# Altium schematic sheet 0213_5V_L.SchDoc
size 848 x 558 mm
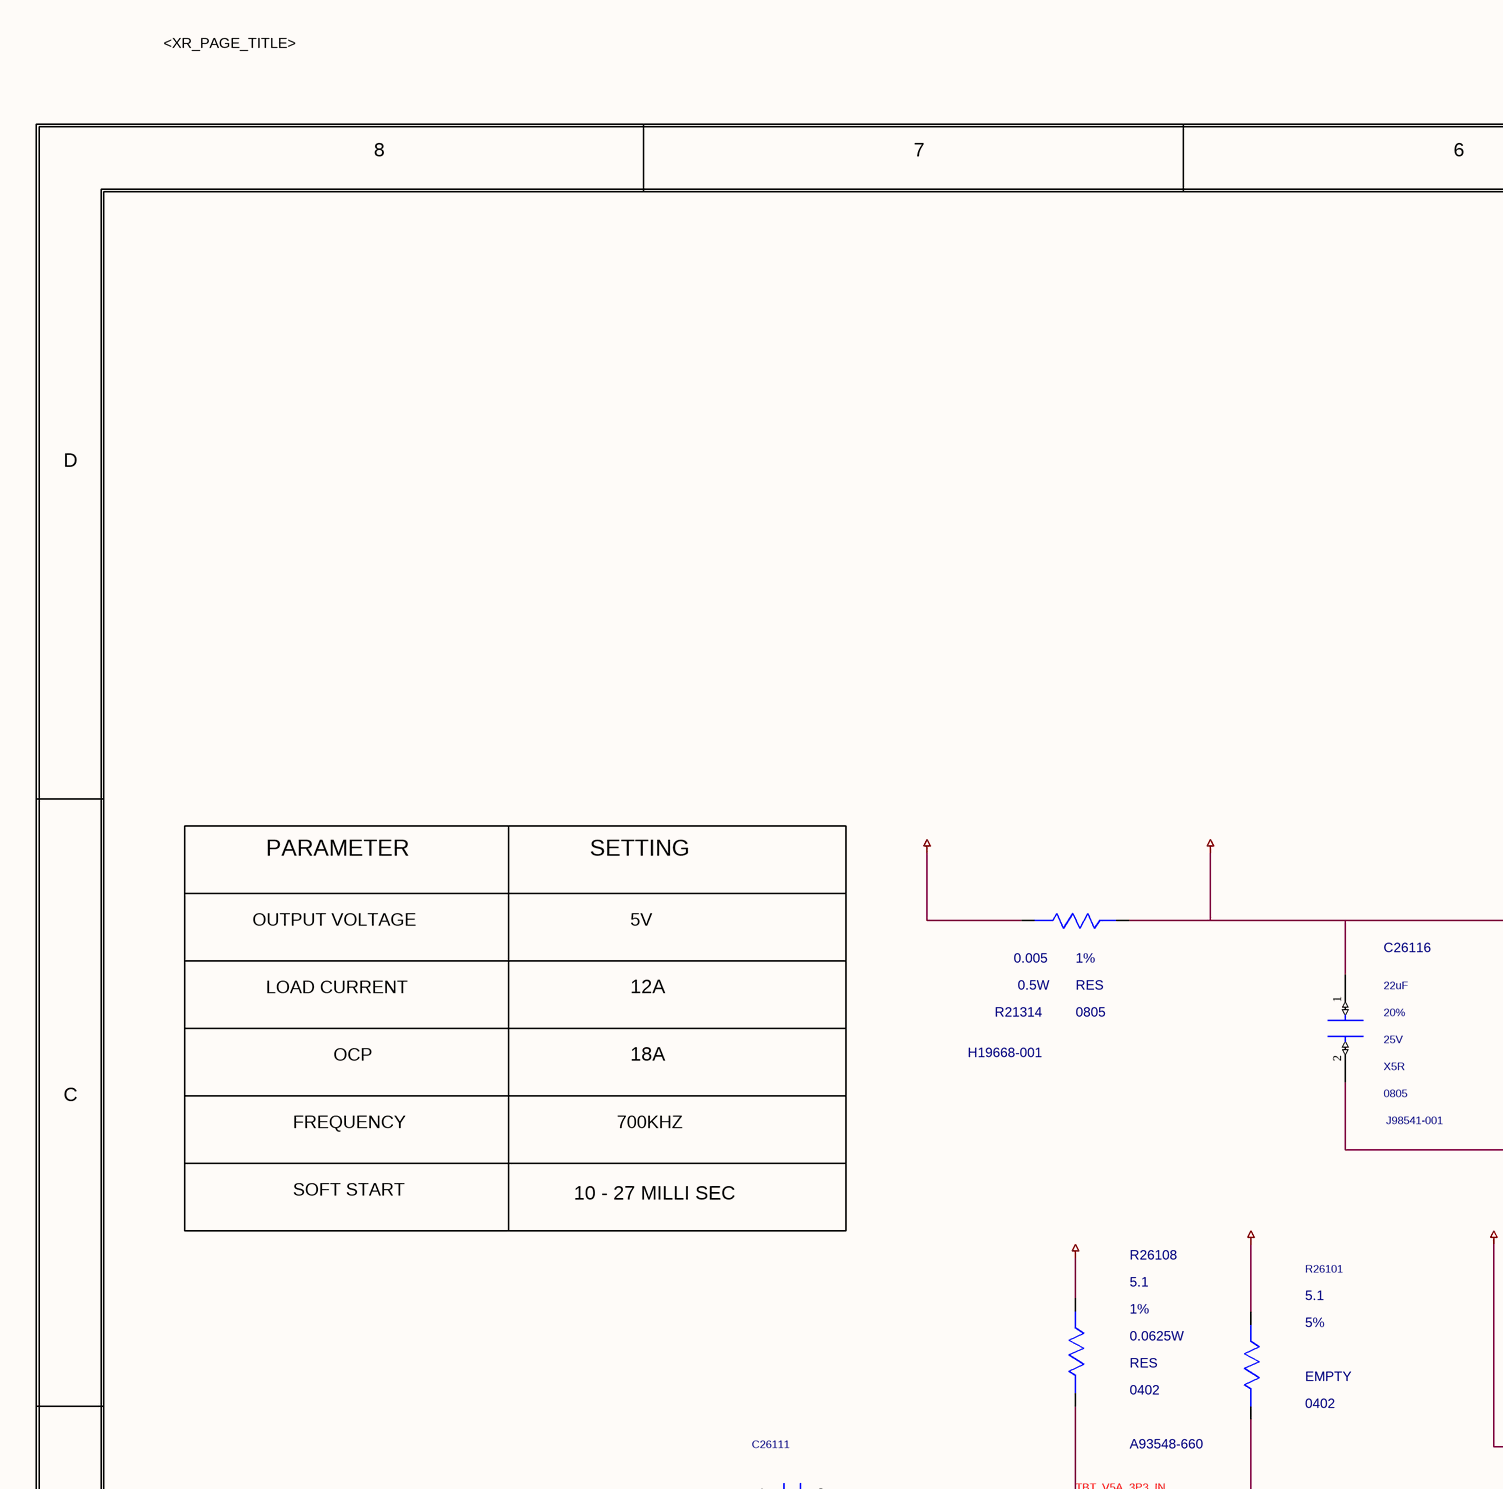
[diagram p0: 0213_5V_L.SchDoc, top left]
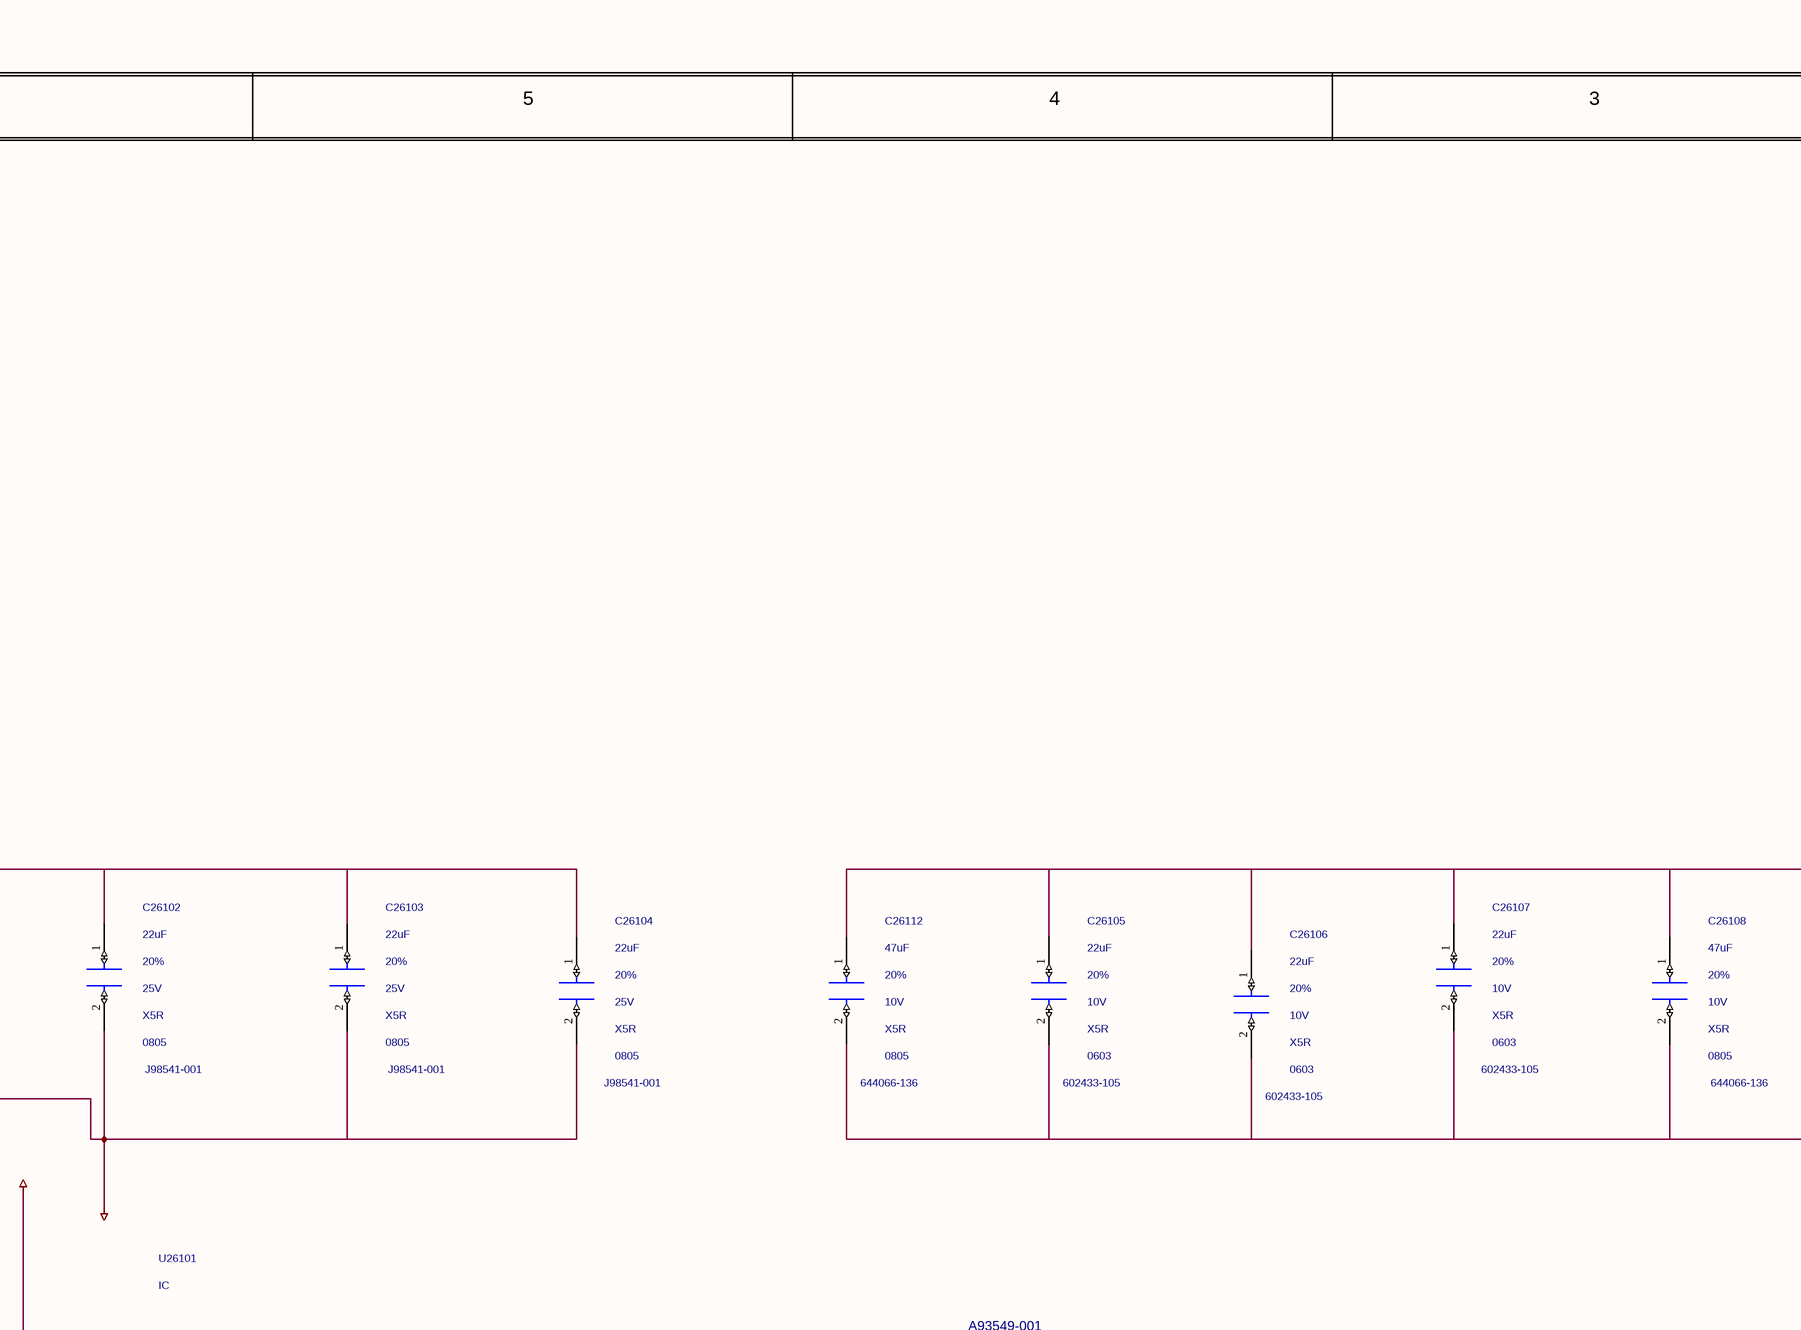
[diagram p1: 0213_5V_L.SchDoc, top middle]
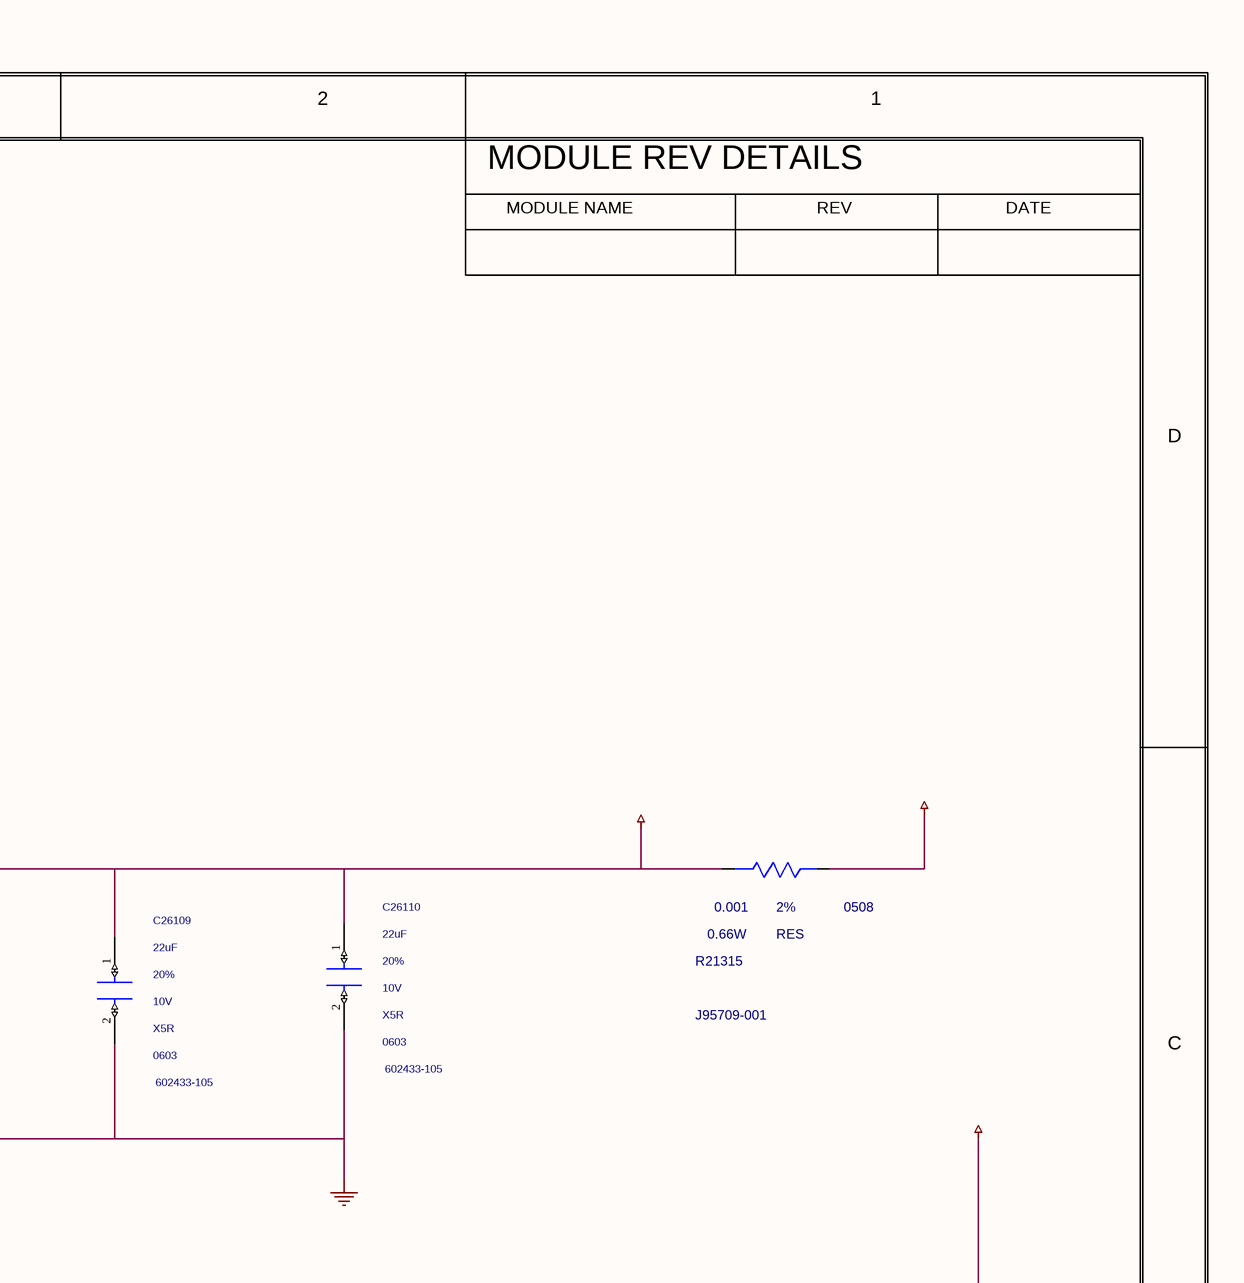
[diagram p2: 0213_5V_L.SchDoc, top right]
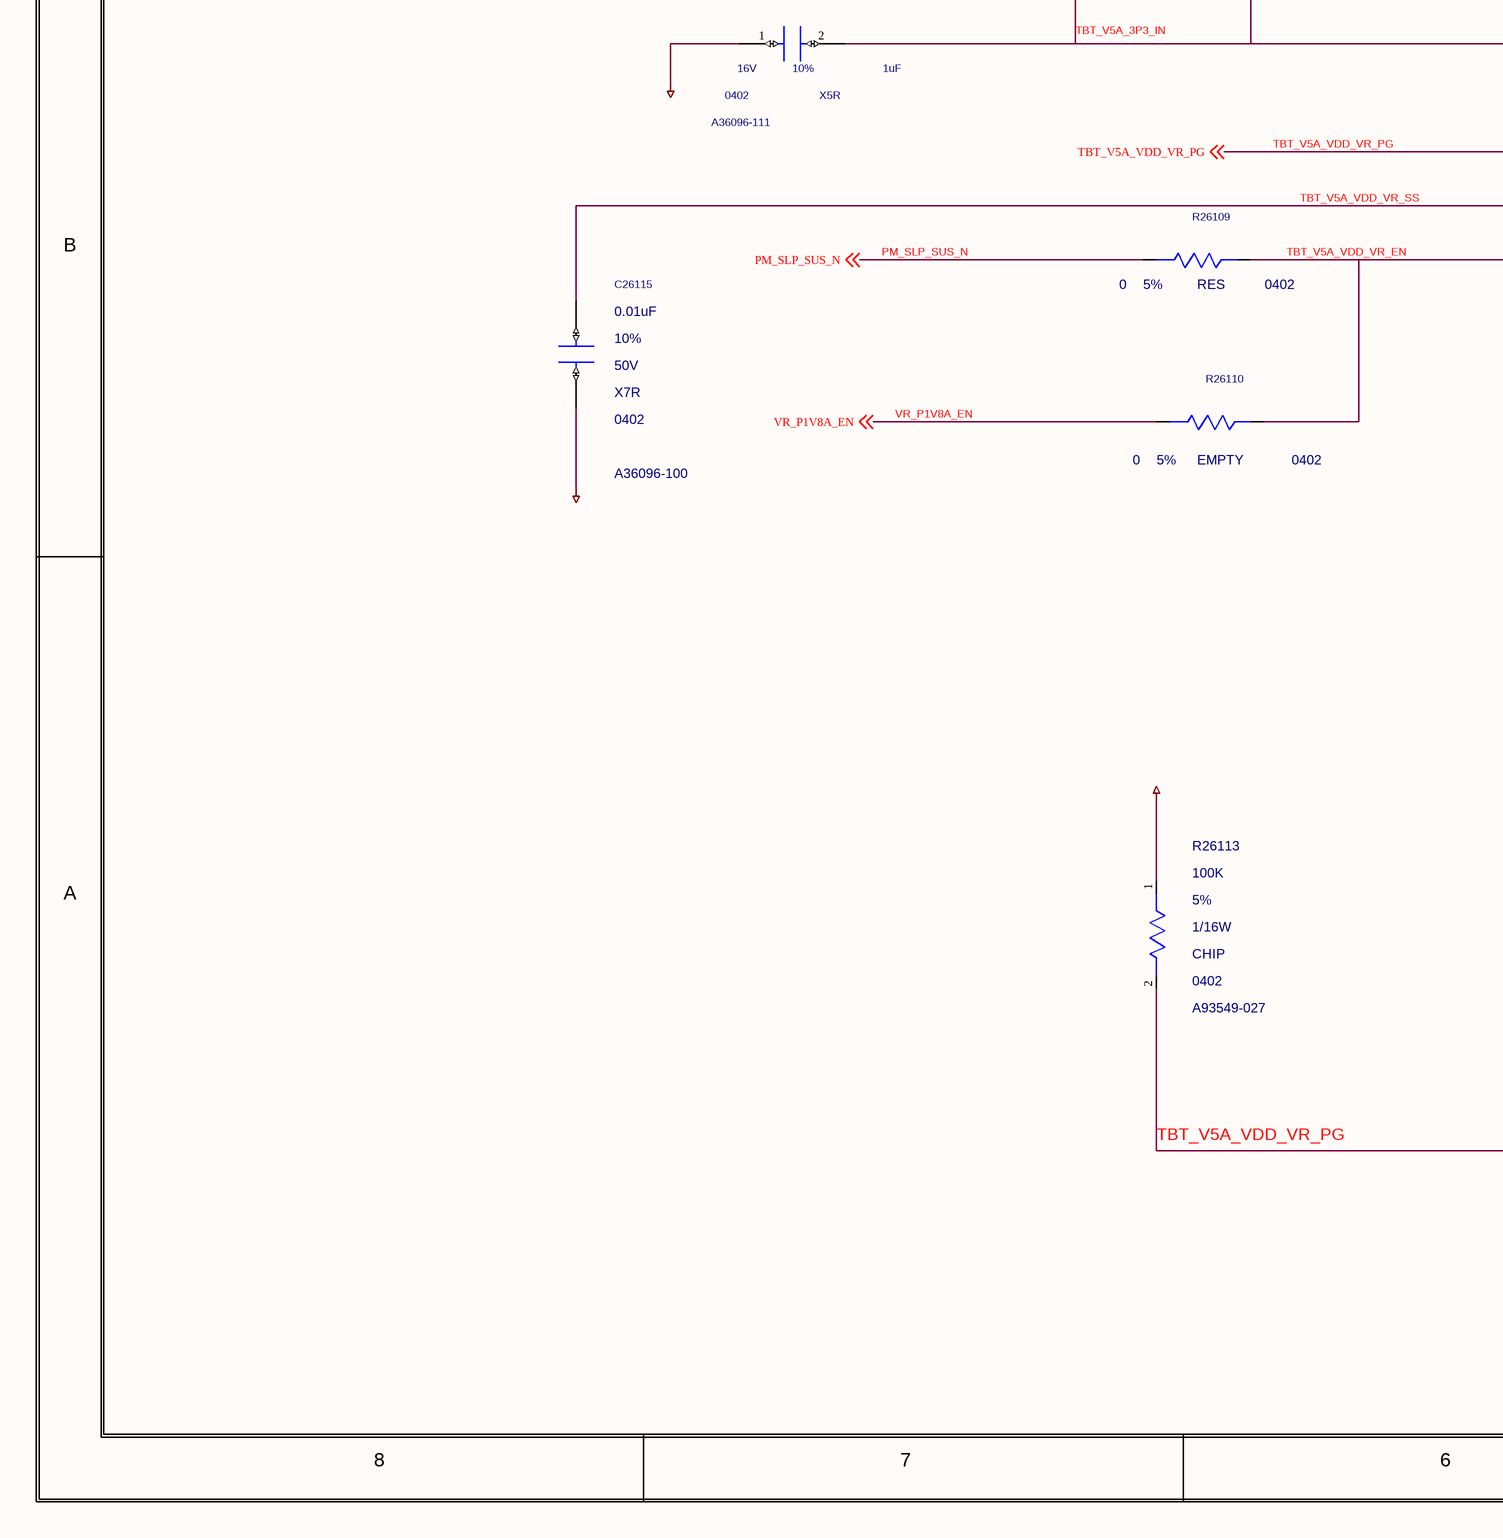
[diagram p3: 0213_5V_L.SchDoc, bottom left]
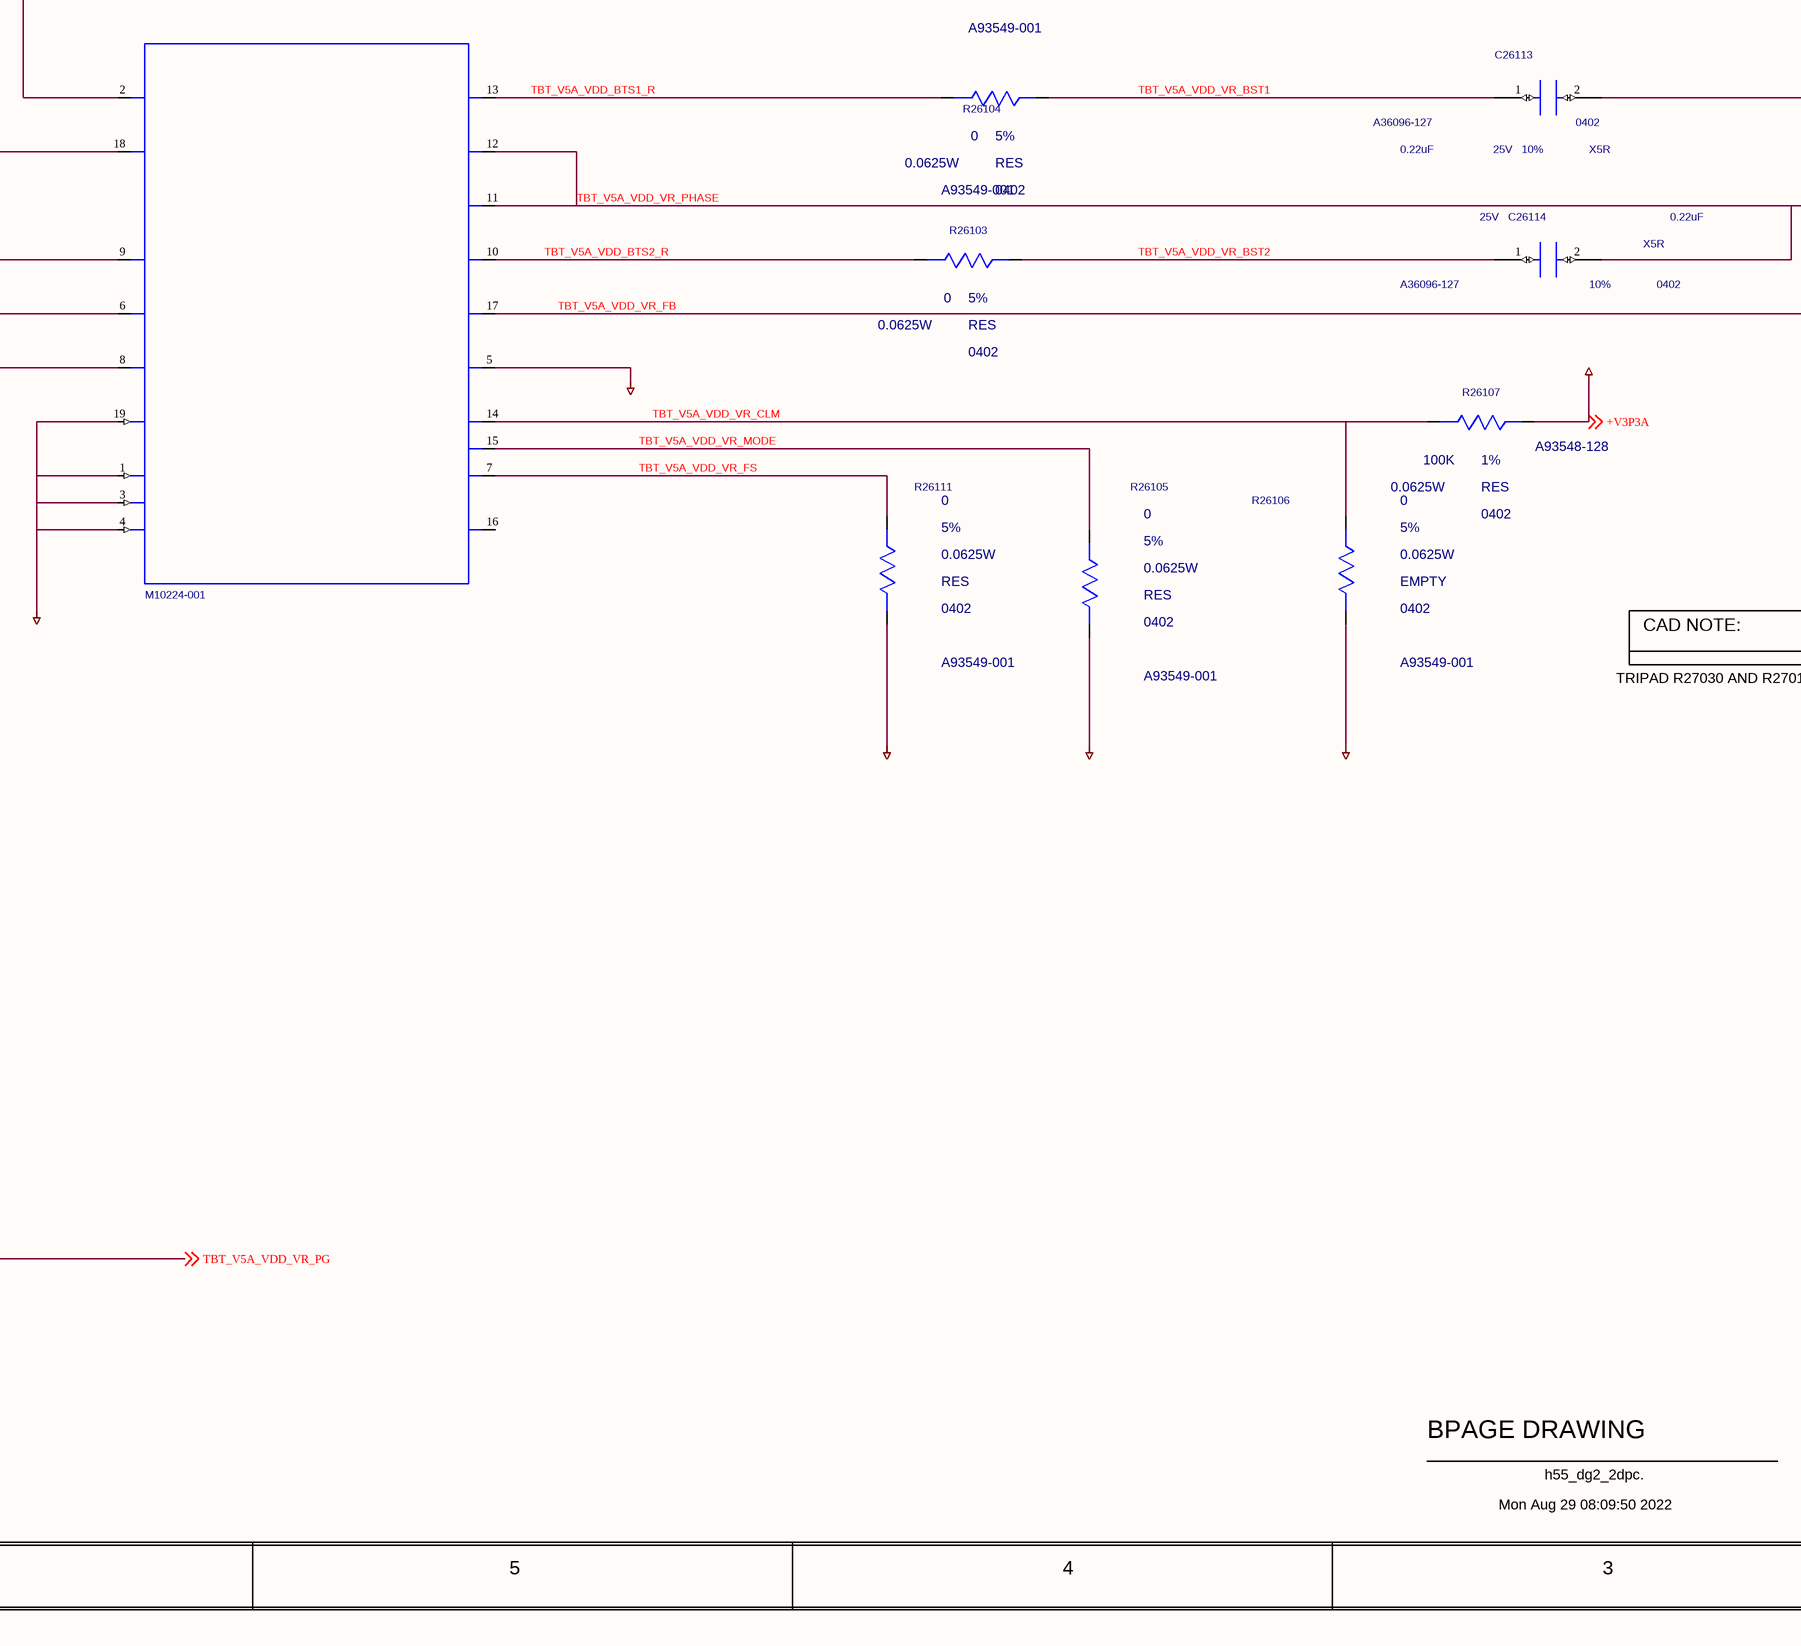
[diagram p4: 0213_5V_L.SchDoc, bottom middle]
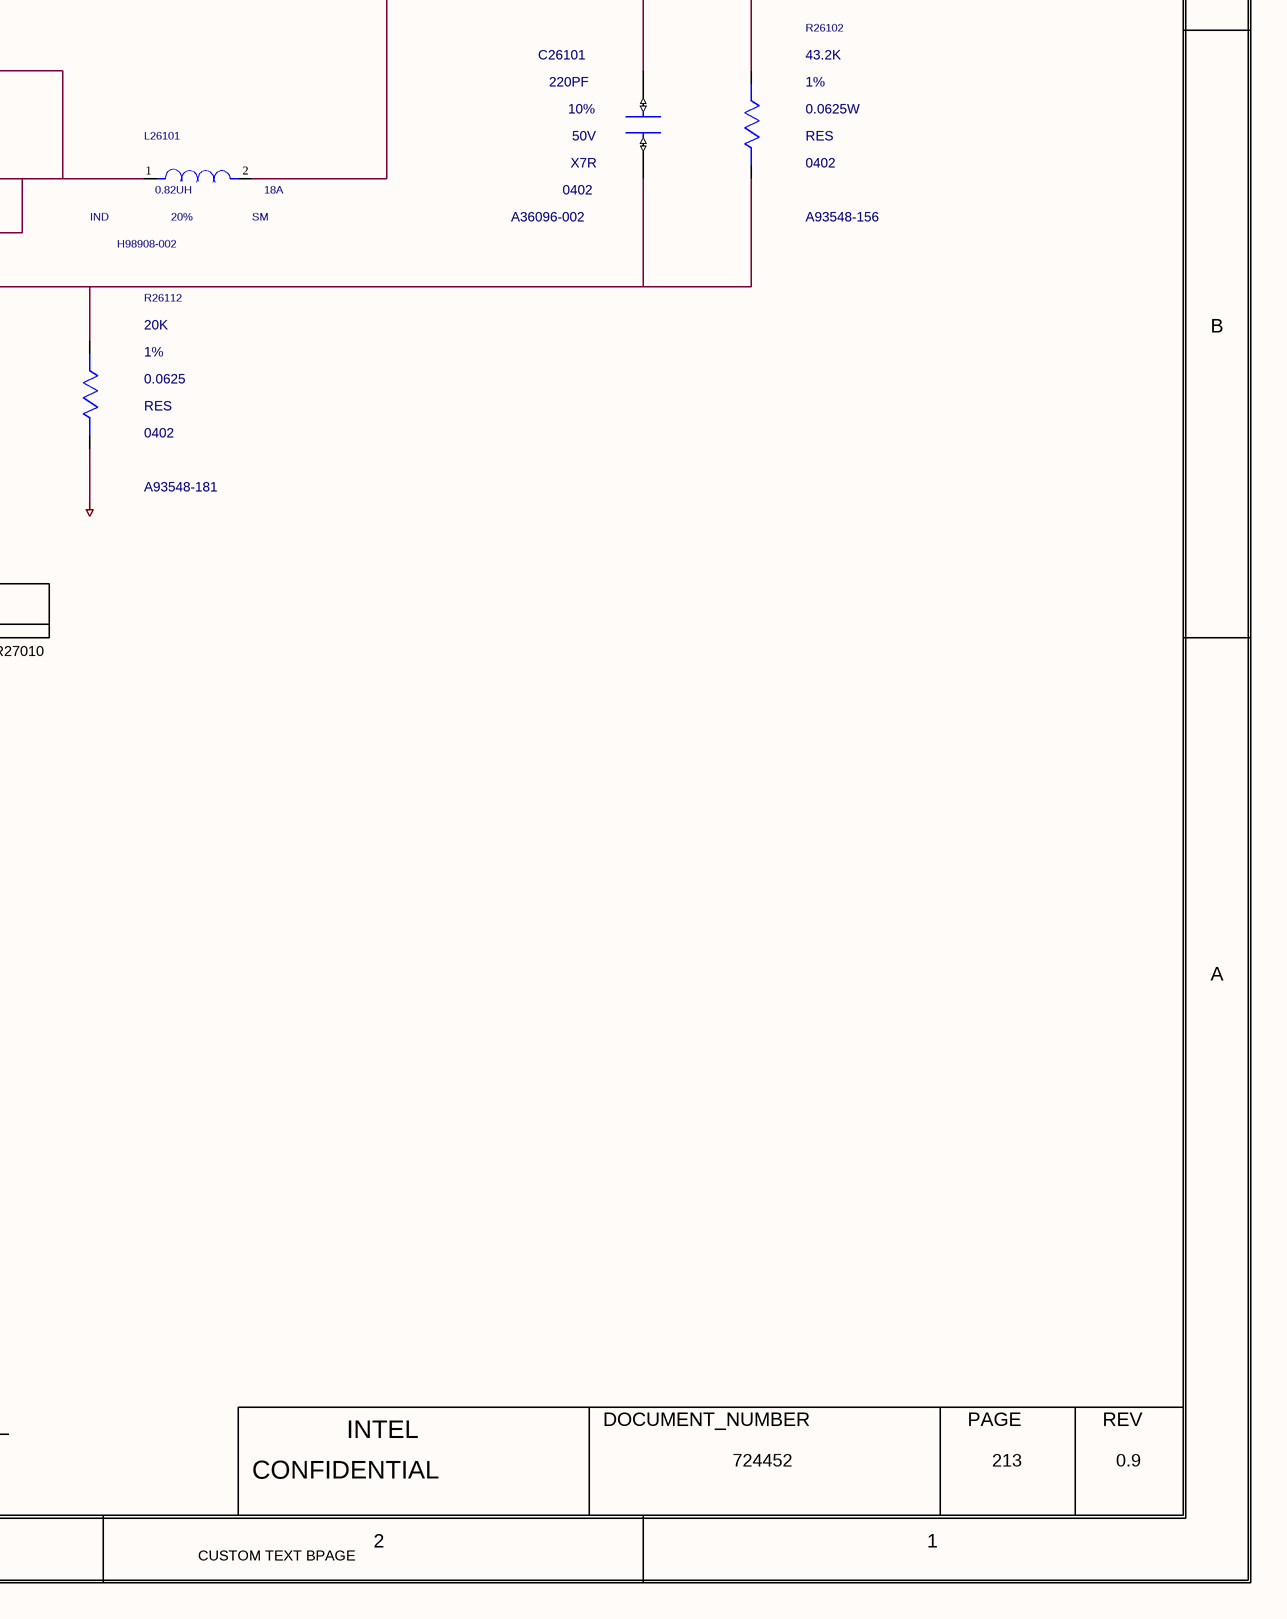
[diagram p5: 0213_5V_L.SchDoc, bottom right]

## Parts
C26101  220PF  MATERIAL: X7R  PACK_TYPE: 0402  PART_NUMBER: A36096-002  TOLERANCE: 10%  VOLTAGE: 50V  [CTK0_SM0402_1100X600_MA]
C26102  22uF  MATERIAL: X5R  PACK_TYPE: 0805  PART_NUMBER: J98541-001  TOLERANCE: 20%  VOLTAGE: 25V  [SMC0805MA]
C26103  22uF  MATERIAL: X5R  PACK_TYPE: 0805  PART_NUMBER: J98541-001  TOLERANCE: 20%  VOLTAGE: 25V  [SMC0805MA]
C26104  22uF  MATERIAL: X5R  PACK_TYPE: 0805  PART_NUMBER: J98541-001  TOLERANCE: 20%  VOLTAGE: 25V  [SMC0805MA]
C26105  22uF  MATERIAL: X5R  PACK_TYPE: 0603  PART_NUMBER: 602433-105  TOLERANCE: 20%  VOLTAGE: 10V  [SMC0603IA]
C26106  22uF  MATERIAL: X5R  PACK_TYPE: 0603  PART_NUMBER: 602433-105  TOLERANCE: 20%  VOLTAGE: 10V  [SMC0603IA]
C26107  22uF  MATERIAL: X5R  PACK_TYPE: 0603  PART_NUMBER: 602433-105  TOLERANCE: 20%  VOLTAGE: 10V  [SMC0603IA]
C26108  47uF  MATERIAL: X5R  PACK_TYPE: 0805  PART_NUMBER: 644066-136  TOLERANCE: 20%  VOLTAGE: 10V  [SMC0805MA]
C26109  22uF  MATERIAL: X5R  PACK_TYPE: 0603  PART_NUMBER: 602433-105  TOLERANCE: 20%  VOLTAGE: 10V  [SMC0603IA]
C26110  22uF  MATERIAL: X5R  PACK_TYPE: 0603  PART_NUMBER: 602433-105  TOLERANCE: 20%  VOLTAGE: 10V  [SMC0603IA]
C26111  1uF  MATERIAL: X5R  PACK_TYPE: 0402  PART_NUMBER: A36096-111  TOLERANCE: 10%  VOLTAGE: 16V  [SMC0402IA]
C26112  47uF  MATERIAL: X5R  PACK_TYPE: 0805  PART_NUMBER: 644066-136  TOLERANCE: 20%  VOLTAGE: 10V  [SMC0805MA]
C26113  0.22uF  MATERIAL: X5R  PACK_TYPE: 0402  PART_NUMBER: A36096-127  TOLERANCE: 10%  VOLTAGE: 25V  [SMC1005MB]
C26114  0.22uF  MATERIAL: X5R  PACK_TYPE: 0402  PART_NUMBER: A36096-127  TOLERANCE: 10%  VOLTAGE: 25V  [SMC1005MB]
C26115  0.01uF  MATERIAL: X7R  PACK_TYPE: 0402  PART_NUMBER: A36096-100  TOLERANCE: 10%  VOLTAGE: 50V  [CTK2_SM0402_1050X550_MA]
C26116  22uF  MATERIAL: X5R  PACK_TYPE: 0805  PART_NUMBER: J98541-001  TOLERANCE: 20%  VOLTAGE: 25V  [SMC0805MA]
L26101  0.82UH  CURRENT: 18A  MATERIAL: IND  PACK_TYPE: SM  PART_NUMBER: H98908-002  TOLERANCE: 20%  [CTK0_SM_7300X6800_MA]
R21314  0.005  MATERIAL: RES  PACK_TYPE: 0805  PART_NUMBER: H19668-001  TOLERANCE: 1%  WATTAGE: 0.5W  [CTK2_SM0805_2150X1350_MA]
R21315  0.001  MATERIAL: RES  PACK_TYPE: 0508  PART_NUMBER: J95709-001  TOLERANCE: 2%  WATTAGE: 0.66W  [CTK0_SM0508_1350X2150_MA_MR]
R26101  5.1  MATERIAL: EMPTY  PACK_TYPE: 0402  TOLERANCE: 5%  [CTK2_SM0402_1100X550_MA]
R26102  43.2K  MATERIAL: RES  PACK_TYPE: 0402  PART_NUMBER: A93548-156  TOLERANCE: 1%  WATTAGE: 0.0625W  [CTK0_SM0402_1100X550_MA]
R26103  0  MATERIAL: RES  PACK_TYPE: 0402  PART_NUMBER: A93549-001  TOLERANCE: 5%  WATTAGE: 0.0625W  [CTK2_SM0402_1100X550_MA]
R26104  0  MATERIAL: RES  PACK_TYPE: 0402  PART_NUMBER: A93549-001  TOLERANCE: 5%  WATTAGE: 0.0625W  [CTK2_SM0402_1100X550_MA]
R26105  0  MATERIAL: RES  PACK_TYPE: 0402  PART_NUMBER: A93549-001  TOLERANCE: 5%  WATTAGE: 0.0625W  [CTK2_SM0402_1100X550_MA]
R26106  0  MATERIAL: EMPTY  PACK_TYPE: 0402  PART_NUMBER: A93549-001  TOLERANCE: 5%  WATTAGE: 0.0625W  [CTK0_SM0402_1100X550_MA]
R26107  100K  MATERIAL: RES  PACK_TYPE: 0402  PART_NUMBER: A93548-128  TOLERANCE: 1%  WATTAGE: 0.0625W  [CTK0_SM0402_1100X550_MA]
R26108  5.1  MATERIAL: RES  PACK_TYPE: 0402  PART_NUMBER: A93548-660  TOLERANCE: 1%  WATTAGE: 0.0625W  [CTK0_SM0402_1100X550_MA]
R26109  0  MATERIAL: RES  PACK_TYPE: 0402  TOLERANCE: 5%  [CTK2_SM0402_1100X550_MA]
R26110  0  MATERIAL: EMPTY  PACK_TYPE: 0402  TOLERANCE: 5%  [CTK2_SM0402_1100X550_MA]
R26111  0  MATERIAL: RES  PACK_TYPE: 0402  PART_NUMBER: A93549-001  TOLERANCE: 5%  WATTAGE: 0.0625W  [CTK2_SM0402_1100X550_MA]
R26112  20K  MATERIAL: RES  PACK_TYPE: 0402  PART_NUMBER: A93548-181  TOLERANCE: 1%  WATTAGE: 0.0625  [CTK0_SM0402_1100X550_MA]
R26113  100K  MATERIAL: CHIP  PACK_TYPE: 0402  PART_NUMBER: A93549-027  TOLERANCE: 5%  WATTAGE: 1/16W  [SMR0402IA]
U26101  MATERIAL: IC  PART_NUMBER: M10224-001  [CTK1_LCC19_3100X4100_400_MA]  (hidden comment: C_MP2941H)

## Nets
+V3P3A: R26101.1(A) R26107.2(B) ; off-sheet +V3P3A
+V3P3DSW: R26113.1(A)
+V5A_L: R21315.2(B)
+V5A_L_R: C26101.1(A) C26105.1(A) C26106.1(A) C26107.1(A) C26108.1(A) C26109.1(A) C26110.1(A) C26112.1(A) L26101.2(INB) R21315.1(A) R26102.1(A)
+VBATA: R21314.1(A)
+VBATA_V5A_L: C26102.1(A) C26103.1(A) C26104.1(A) C26116.1(A) R21314.2(B) U26101.2(VIN)
+VREG3P3_DSW: R26108.1(A)
GND: C26102.2(B) C26103.2(B) C26104.2(B) C26105.2(B) C26106.2(B) C26107.2(B) C26108.2(B) C26109.2(B) C26110.2(B) C26111.1(A) C26112.2(B) C26115.2(B) C26116.2(B) R26105.2(B) R26106.2(B) R26111.2(B) R26112.2(B) U26101.1(PGND_1) U26101.3(PGND_2) U26101.4(PGND_3) U26101.5(TONEXT) U26101.19(AGND)
PM_SLP_SUS_N: R26109.1(A) ; off-sheet PM_SLP_SUS_N
TBT_V5A_3P3_IN: C26111.2(B) R26101.2(B) R26108.2(B) U26101.18(3V3)
TBT_V5A_VDD_BTS1_R: R26104.1(A) U26101.13(BST1)
TBT_V5A_VDD_BTS2_R: R26103.1(A) U26101.10(BST2)
TBT_V5A_VDD_VR_BST1: C26113.1(A) R26104.2(B)
TBT_V5A_VDD_VR_BST2: C26114.1(A) R26103.2(B)
TBT_V5A_VDD_VR_CLM: R26106.1(A) R26107.1(A) U26101.14(CLM)
TBT_V5A_VDD_VR_EN: R26109.2(B) R26110.2(B) U26101.8(EN)
TBT_V5A_VDD_VR_FB: C26101.2(B) R26102.2(B) R26112.1(A) U26101.17(FB)
TBT_V5A_VDD_VR_FS: R26111.1(A) U26101.7(FS)
TBT_V5A_VDD_VR_MODE: R26105.1(A) U26101.15(MODE)
TBT_V5A_VDD_VR_PG: R26113.2(B) U26101.9(PG) ; off-sheet TBT_V5A_VDD_VR_PG
TBT_V5A_VDD_VR_PHASE: C26113.2(B) C26114.2(B) L26101.1(INA) U26101.11(SW2) U26101.12(SW1)
TBT_V5A_VDD_VR_SS: C26115.1(A) U26101.6(SS)
VR_P1V8A_EN: R26110.1(A) ; off-sheet VR_P1V8A_EN

Not connected (* = marked no-connect by the designer): U26101 16(NC)

## Notes on the sheet
- <XR_PAGE_TITLE>
- 8
- 7
- 6
- 5
- 4
- 3
- 2
- 1
- MODULE REV DETAILS
- MODULE NAME
- REV
- DATE
- D
- PARAMETER
- SETTING
- OUTPUT VOLTAGE
- 5V
- LOAD CURRENT
- 12A
- OCP
- 18A
- C
- FREQUENCY
- 700KHZ
- SOFT START
- 10 - 27 MILLI SEC
- B
- CAD NOTE:
- TRIPAD R27030 AND R27010
- A
- BPAGE DRAWING
- INTEL
- DOCUMENT_NUMBER
- PAGE
- Mon Aug 29 08:09:50 2022
- h55_dg2_2dpc.
- CONFIDENTIAL
- 724452
- 213
- 0.9
- CUSTOM TEXT BPAGE

## Library data of the parts
C26101 = C_CAP: CDS_PHYS_PART_NAME: C_CAP_0402-A36096-002,X7R,220PF,50V,10%,TK0,GENERIC; CDS_LMAN_SYM_OUTLINE: -50,50,50,-50; FP_TECH: TK0; IP: GENERIC; ROOM: NONE; OriginalSymbolOrigin: (-50,25); XY: (-7400,3250); VER: 1; ROT: 2; PHYS_PAGE: 213; LOCATION: C26101; DRAWING: @RVP1_ADL_SB_ADP_S_DDR5_SODIMM_2DPC_LIB.H55_DG2_2DPC(SCH_1):PAGE582; CDS_LIB: c_discrete; VARIANT: ?; PCB Footprint: CTK0_SM0402_1100X600_MA; SEC_TYPE: 0402; CHIPS_PART_NAME: C_CAP; CDS_PART_NAME: C_CAP_0402-A36096-002,X7R,220PF,50V,10%,TK0,GENERIC; CDS_LOCATION: C26101
C26102 = CAP: CDS_PHYS_PART_NAME: CAP_0805-J98541-001,X5R,22UF,25V,20%,LPDB,GENERIC; OriginalSymbolOrigin: (-50,25); XY: (-11675,4125); VER: 1; ROT: 0; PHYS_PAGE: 213; LOCATION: C26102; DRAWING: @RVP1_ADL_SB_ADP_S_DDR5_SODIMM_2DPC_LIB.H55_DG2_2DPC(SCH_1):PAGE582; CDS_LIB: discrete; PCB Footprint: SMC0805MA; SEC_TYPE: 0805; CHIPS_PART_NAME: CAP; CDS_PART_NAME: CAP_0805-J98541-001,X5R,22UF,25V,20%,LPDB,GENERIC; CDS_LOCATION: C26102
C26103 = CAP: CDS_PHYS_PART_NAME: CAP_0805-J98541-001,X5R,22UF,25V,20%,LPDB,GENERIC; OriginalSymbolOrigin: (-50,25); XY: (-11225,4125); VER: 1; ROT: 0; PHYS_PAGE: 213; LOCATION: C26103; DRAWING: @RVP1_ADL_SB_ADP_S_DDR5_SODIMM_2DPC_LIB.H55_DG2_2DPC(SCH_1):PAGE582; CDS_LIB: discrete; PCB Footprint: SMC0805MA; SEC_TYPE: 0805; CHIPS_PART_NAME: CAP; CDS_PART_NAME: CAP_0805-J98541-001,X5R,22UF,25V,20%,LPDB,GENERIC; CDS_LOCATION: C26103
C26104 = CAP: CDS_PHYS_PART_NAME: CAP_0805-J98541-001,X5R,22UF,25V,20%,LPDB,GENERIC; OriginalSymbolOrigin: (-50,25); XY: (-10800,4100); VER: 1; ROT: 0; PHYS_PAGE: 213; LOCATION: C26104; DRAWING: @RVP1_ADL_SB_ADP_S_DDR5_SODIMM_2DPC_LIB.H55_DG2_2DPC(SCH_1):PAGE582; CDS_LIB: discrete; PCB Footprint: SMC0805MA; SEC_TYPE: 0805; CHIPS_PART_NAME: CAP; CDS_PART_NAME: CAP_0805-J98541-001,X5R,22UF,25V,20%,LPDB,GENERIC; CDS_LOCATION: C26104
C26105 = CAP: CDS_PHYS_PART_NAME: CAP_0603-602433-105,X5R,22UF,10V,20%,LPDB,GENERIC; OriginalSymbolOrigin: (-50,25); XY: (-9925,4100); VER: 1; ROT: 0; PHYS_PAGE: 213; LOCATION: C26105; DRAWING: @RVP1_ADL_SB_ADP_S_DDR5_SODIMM_2DPC_LIB.H55_DG2_2DPC(SCH_1):PAGE582; CDS_LIB: discrete; PCB Footprint: SMC0603IA; SEC_TYPE: 0603; CHIPS_PART_NAME: CAP; CDS_PART_NAME: CAP_0603-602433-105,X5R,22UF,10V,20%,LPDB,GENERIC; CDS_LOCATION: C26105
C26106 = CAP: CDS_PHYS_PART_NAME: CAP_0603-602433-105,X5R,22UF,10V,20%,LPDB,GENERIC; OriginalSymbolOrigin: (-50,25); XY: (-9550,4075); VER: 1; ROT: 0; PHYS_PAGE: 213; LOCATION: C26106; DRAWING: @RVP1_ADL_SB_ADP_S_DDR5_SODIMM_2DPC_LIB.H55_DG2_2DPC(SCH_1):PAGE582; CDS_LIB: discrete; PCB Footprint: SMC0603IA; SEC_TYPE: 0603; CHIPS_PART_NAME: CAP; CDS_PART_NAME: CAP_0603-602433-105,X5R,22UF,10V,20%,LPDB,GENERIC; CDS_LOCATION: C26106
C26107 = CAP: CDS_PHYS_PART_NAME: CAP_0603-602433-105,X5R,22UF,10V,20%,LPDB,GENERIC; OriginalSymbolOrigin: (-50,25); XY: (-9175,4125); VER: 1; ROT: 0; PHYS_PAGE: 213; LOCATION: C26107; DRAWING: @RVP1_ADL_SB_ADP_S_DDR5_SODIMM_2DPC_LIB.H55_DG2_2DPC(SCH_1):PAGE582; CDS_LIB: discrete; PCB Footprint: SMC0603IA; SEC_TYPE: 0603; CHIPS_PART_NAME: CAP; CDS_PART_NAME: CAP_0603-602433-105,X5R,22UF,10V,20%,LPDB,GENERIC; CDS_LOCATION: C26107
C26108 = CAP: CDS_PHYS_PART_NAME: CAP_0805-644066-136,X5R,47UF,10V,20%,LPDB,GENERIC; OriginalSymbolOrigin: (-50,25); XY: (-8775,4100); VER: 1; ROT: 0; PHYS_PAGE: 213; LOCATION: C26108; DRAWING: @RVP1_ADL_SB_ADP_S_DDR5_SODIMM_2DPC_LIB.H55_DG2_2DPC(SCH_1):PAGE582; CDS_LIB: discrete; PCB Footprint: SMC0805MA; SEC_TYPE: 0805; CHIPS_PART_NAME: CAP; CDS_PART_NAME: CAP_0805-644066-136,X5R,47UF,10V,20%,LPDB,GENERIC; CDS_LOCATION: C26108
C26109 = CAP: CDS_PHYS_PART_NAME: CAP_0603-602433-105,X5R,22UF,10V,20%,LPDB,GENERIC; OriginalSymbolOrigin: (-50,25); XY: (-8300,4100); VER: 1; ROT: 0; PHYS_PAGE: 213; LOCATION: C26109; DRAWING: @RVP1_ADL_SB_ADP_S_DDR5_SODIMM_2DPC_LIB.H55_DG2_2DPC(SCH_1):PAGE582; CDS_LIB: discrete; PCB Footprint: SMC0603IA; SEC_TYPE: 0603; CHIPS_PART_NAME: CAP; CDS_PART_NAME: CAP_0603-602433-105,X5R,22UF,10V,20%,LPDB,GENERIC; CDS_LOCATION: C26109
C26110 = CAP: CDS_PHYS_PART_NAME: CAP_0603-602433-105,X5R,22UF,10V,20%,LPDB,GENERIC; OriginalSymbolOrigin: (-50,25); XY: (-7875,4125); VER: 1; ROT: 0; PHYS_PAGE: 213; LOCATION: C26110; DRAWING: @RVP1_ADL_SB_ADP_S_DDR5_SODIMM_2DPC_LIB.H55_DG2_2DPC(SCH_1):PAGE582; CDS_LIB: discrete; PCB Footprint: SMC0603IA; SEC_TYPE: 0603; CHIPS_PART_NAME: CAP; CDS_PART_NAME: CAP_0603-602433-105,X5R,22UF,10V,20%,LPDB,GENERIC; CDS_LOCATION: C26110
C26111 = CAP#1: CHIPS_PART_NAME: CAP; CDS_PHYS_PART_NAME: CAP_0402-A36096-111,X5R,1UF,16V,10%,LPDB,GENERIC; OriginalSymbolOrigin: (-25,50); XY: (-13125,3250); VER: 2; ROT: 0; PHYS_PAGE: 213; LOCATION: C26111; DRAWING: @RVP1_ADL_SB_ADP_S_DDR5_SODIMM_2DPC_LIB.H55_DG2_2DPC(SCH_1):PAGE582; CDS_LIB: discrete; PCB Footprint: SMC0402IA; CDS_PART_NAME: CAP_0402-A36096-111,X5R,1UF,16V,10%,LPDB,GENERIC; CDS_LOCATION: C26111
C26112 = CAP: CDS_PHYS_PART_NAME: CAP_0805-644066-136,X5R,47UF,10V,20%,LPDB,GENERIC; OriginalSymbolOrigin: (-50,25); XY: (-10300,4100); VER: 1; ROT: 0; PHYS_PAGE: 213; LOCATION: C26112; DRAWING: @RVP1_ADL_SB_ADP_S_DDR5_SODIMM_2DPC_LIB.H55_DG2_2DPC(SCH_1):PAGE582; CDS_LIB: discrete; PCB Footprint: SMC0805MA; CHIPS_PART_NAME: CAP; CDS_PART_NAME: CAP_0805-644066-136,X5R,47UF,10V,20%,LPDB,GENERIC; CDS_LOCATION: C26112
C26113 = CAP#1: CHIPS_PART_NAME: CAP; CDS_PHYS_PART_NAME: CAP_0402-A36096-127,X5R,0.22UF,25V,10%,LPDB,GENERIC; OriginalSymbolOrigin: (-25,50); XY: (-9000,3350); VER: 2; ROT: 0; PHYS_PAGE: 213; LOCATION: C26113; DRAWING: @RVP1_ADL_SB_ADP_S_DDR5_SODIMM_2DPC_LIB.H55_DG2_2DPC(SCH_1):PAGE582; CDS_LIB: discrete; PCB Footprint: SMC1005MB; CDS_PART_NAME: CAP_0402-A36096-127,X5R,0.22UF,25V,10%,LPDB,GENERIC; CDS_LOCATION: C26113
C26114 = CAP#1: CHIPS_PART_NAME: CAP; CDS_PHYS_PART_NAME: CAP_0402-A36096-127,X5R,0.22UF,25V,10%,LPDB,GENERIC; OriginalSymbolOrigin: (-25,50); XY: (-9000,3050); VER: 2; ROT: 0; PHYS_PAGE: 213; LOCATION: C26114; DRAWING: @RVP1_ADL_SB_ADP_S_DDR5_SODIMM_2DPC_LIB.H55_DG2_2DPC(SCH_1):PAGE582; CDS_LIB: discrete; PCB Footprint: SMC1005MB; CDS_PART_NAME: CAP_0402-A36096-127,X5R,0.22UF,25V,10%,LPDB,GENERIC; CDS_LOCATION: C26114
C26115 = C_CAP: CDS_PHYS_PART_NAME: C_CAP_0402-A36096-100,X7R,0.01UF,50V,10%,TK2,GENERIC; CDS_LMAN_SYM_OUTLINE: -50,50,50,-50; FP_TECH: TK2; IP: GENERIC; ROOM: NONE; OriginalSymbolOrigin: (-50,25); XY: (-13525,2675); VER: 1; ROT: 0; PHYS_PAGE: 213; LOCATION: C26115; DRAWING: @RVP1_ADL_SB_ADP_S_DDR5_SODIMM_2DPC_LIB.H55_DG2_2DPC(SCH_1):PAGE582; CDS_LIB: c_discrete; VARIANT: ?; PCB Footprint: CTK2_SM0402_1050X550_MA; CHIPS_PART_NAME: C_CAP; CDS_PART_NAME: C_CAP_0402-A36096-100,X7R,0.01UF,50V,10%,TK2,GENERIC; CDS_LOCATION: C26115
C26116 = CAP: CDS_PHYS_PART_NAME: CAP_0805-J98541-001,X5R,22UF,25V,20%,LPDB,GENERIC; OriginalSymbolOrigin: (-50,25); XY: (-12100,4125); VER: 1; ROT: 0; PHYS_PAGE: 213; LOCATION: C26116; DRAWING: @RVP1_ADL_SB_ADP_S_DDR5_SODIMM_2DPC_LIB.H55_DG2_2DPC(SCH_1):PAGE582; CDS_LIB: discrete; PCB Footprint: SMC0805MA; CHIPS_PART_NAME: CAP; CDS_PART_NAME: CAP_0805-J98541-001,X5R,22UF,25V,20%,LPDB,GENERIC; CDS_LOCATION: C26116
L26101 = C_INDUCTOR: CDS_PHYS_PART_NAME: C_INDUCTOR_SM-H98908-002,IND,0.82UH,20%,18A,TK0,GENERIC; CDS_LMAN_SYM_OUTLINE: -100,50,100,-50; FP_TECH: TK0; IP: GENERIC; ROOM: NONE; OriginalSymbolOrigin: (-75,25); XY: (-8225,3150); VER: 1; ROT: 0; PHYS_PAGE: 213; LOCATION: L26101; DRAWING: @RVP1_ADL_SB_ADP_S_DDR5_SODIMM_2DPC_LIB.H55_DG2_2DPC(SCH_1):PAGE582; CDS_LIB: local; VARIANT: ?; PCB Footprint: CTK0_SM_7300X6800_MA; SEC_TYPE: SM; CHIPS_PART_NAME: C_INDUCTOR; CDS_PART_NAME: C_INDUCTOR_SM-H98908-002,IND,0.82UH,20%,18A,TK0,GENERIC; CDS_LOCATION: L26101
R21314 = C_RES#1: CHIPS_PART_NAME: C_RES; CDS_PHYS_PART_NAME: C_RES_0805-H19668-001,RES,0.005,1%,0.5W,TK2,GENERIC; CDS_LMAN_SYM_OUTLINE: -50,50,50,-50; FP_TECH: TK2; IP: GENERIC; ROOM: NONE; OriginalSymbolOrigin: (-75,25); XY: (-12600,4325); VER: 1; ROT: 0; PHYS_PAGE: 213; LOCATION: R21314; DRAWING: @RVP1_ADL_SB_ADP_S_DDR5_SODIMM_2DPC_LIB.H55_DG2_2DPC(SCH_1):PAGE582; CDS_LIB: c_discrete; VARIANT: ?; PCB Footprint: CTK2_SM0805_2150X1350_MA; CDS_PART_NAME: C_RES_0805-H19668-001,RES,0.005,1%,0.5W,TK2,GENERIC; CDS_LOCATION: R21314
R21315 = C_RES#1: CHIPS_PART_NAME: C_RES; CDS_PHYS_PART_NAME: C_RES_0508-J95709-001,RES,0.001,2%,0.66W,TK0,GENERIC; CDS_LMAN_SYM_OUTLINE: -50,50,50,-50; FP_TECH: TK0; IP: GENERIC; ROOM: NONE; OriginalSymbolOrigin: (-75,25); XY: (-7075,4325); VER: 1; ROT: 0; PHYS_PAGE: 213; LOCATION: R21315; DRAWING: @RVP1_ADL_SB_ADP_S_DDR5_SODIMM_2DPC_LIB.H55_DG2_2DPC(SCH_1):PAGE582; CDS_LIB: c_discrete; VARIANT: ?; PCB Footprint: CTK0_SM0508_1350X2150_MA_MR; CDS_PART_NAME: C_RES_0508-J95709-001,RES,0.001,2%,0.66W,TK0,GENERIC; CDS_LOCATION: R21315
R26101 = C_RES: PART_NUMBER: A93549-060; CDS_PHYS_PART_NAME: C_RES_0402-A93549-060,EMPTY,5.1,5%,0.0625W,TK2,GENERIC; CDS_LMAN_SYM_OUTLINE: -50,50,50,-50; FP_TECH: TK2; IP: GENERIC; ROOM: NONE; WATTAGE: 0.0625W; OriginalSymbolOrigin: (-25,75); XY: (-12275,3500); VER: 2; ROT: 0; PHYS_PAGE: 213; LOCATION: R26101; DRAWING: @RVP1_ADL_SB_ADP_S_DDR5_SODIMM_2DPC_LIB.H55_DG2_2DPC(SCH_1):PAGE582; CDS_LIB: c_discrete; VARIANT: ?; PCB Footprint: CTK2_SM0402_1100X550_MA; SEC_TYPE: 0402; CHIPS_PART_NAME: C_RES; CDS_PART_NAME: C_RES_0402-A93549-060,EMPTY,5.1,5%,0.0625W,TK2,GENERIC; CDS_LOCATION: R26101
R26102 = C_RES: CDS_PHYS_PART_NAME: C_RES_0402-A93548-156,RES,43.2K,1%,0.0625W,TK0,GENERIC; CDS_LMAN_SYM_OUTLINE: -50,50,50,-50; FP_TECH: TK0; IP: GENERIC; ROOM: NONE; OriginalSymbolOrigin: (-25,75); XY: (-7200,3250); VER: 2; ROT: 0; PHYS_PAGE: 213; LOCATION: R26102; DRAWING: @RVP1_ADL_SB_ADP_S_DDR5_SODIMM_2DPC_LIB.H55_DG2_2DPC(SCH_1):PAGE582; CDS_LIB: c_discrete; VARIANT: ?; PCB Footprint: CTK0_SM0402_1100X550_MA; SEC_TYPE: 0402; CHIPS_PART_NAME: C_RES; CDS_PART_NAME: C_RES_0402-A93548-156,RES,43.2K,1%,0.0625W,TK0,GENERIC; CDS_LOCATION: R26102
R26103 = C_RES#1: CHIPS_PART_NAME: C_RES; CDS_PHYS_PART_NAME: C_RES_0402-A93549-001,RES,0,5%,0.0625W,TK2,GENERIC; CDS_LMAN_SYM_OUTLINE: -50,50,50,-50; FP_TECH: TK2; IP: GENERIC; ROOM: NONE; OriginalSymbolOrigin: (-75,25); XY: (-10075,3050); VER: 1; PHYS_PAGE: 213; LOCATION: R26103; DRAWING: @RVP1_ADL_SB_ADP_S_DDR5_SODIMM_2DPC_LIB.H55_DG2_2DPC(SCH_1):PAGE582; CDS_LIB: c_discrete; VARIANT: ?; PCB Footprint: CTK2_SM0402_1100X550_MA; ROT: 0; CDS_PART_NAME: C_RES_0402-A93549-001,RES,0,5%,0.0625W,TK2,GENERIC; CDS_LOCATION: R26103
R26104 = C_RES#1: CHIPS_PART_NAME: C_RES; CDS_PHYS_PART_NAME: C_RES_0402-A93549-001,RES,0,5%,0.0625W,TK2,GENERIC; CDS_LMAN_SYM_OUTLINE: -50,50,50,-50; FP_TECH: TK2; IP: GENERIC; ROOM: NONE; OriginalSymbolOrigin: (-75,25); XY: (-10025,3350); VER: 1; PHYS_PAGE: 213; LOCATION: R26104; DRAWING: @RVP1_ADL_SB_ADP_S_DDR5_SODIMM_2DPC_LIB.H55_DG2_2DPC(SCH_1):PAGE582; CDS_LIB: c_discrete; VARIANT: ?; PCB Footprint: CTK2_SM0402_1100X550_MA; ROT: 0; CDS_PART_NAME: C_RES_0402-A93549-001,RES,0,5%,0.0625W,TK2,GENERIC; CDS_LOCATION: R26104
R26105 = C_RES: CDS_PHYS_PART_NAME: C_RES_0402-A93549-001,RES,0,5%,0.0625W,TK2,GENERIC; CDS_LMAN_SYM_OUTLINE: -50,50,50,-50; FP_TECH: TK2; IP: GENERIC; ROOM: NONE; OriginalSymbolOrigin: (-25,75); XY: (-9850,2450); VER: 2; PHYS_PAGE: 213; LOCATION: R26105; DRAWING: @RVP1_ADL_SB_ADP_S_DDR5_SODIMM_2DPC_LIB.H55_DG2_2DPC(SCH_1):PAGE582; CDS_LIB: c_discrete; VARIANT: ?; PCB Footprint: CTK2_SM0402_1100X550_MA; ROT: 0; CHIPS_PART_NAME: C_RES; CDS_PART_NAME: C_RES_0402-A93549-001,RES,0,5%,0.0625W,TK2,GENERIC; CDS_LOCATION: R26105
R26106 = C_RES: CDS_PHYS_PART_NAME: C_RES_0402-A93549-001,EMPTY,0,5%,0.0625W,TK0,GENERIC; CDS_LMAN_SYM_OUTLINE: -50,50,50,-50; FP_TECH: TK0; IP: GENERIC; ROOM: NONE; OriginalSymbolOrigin: (-25,75); XY: (-9375,2475); VER: 2; PHYS_PAGE: 213; LOCATION: R26106; DRAWING: @RVP1_ADL_SB_ADP_S_DDR5_SODIMM_2DPC_LIB.H55_DG2_2DPC(SCH_1):PAGE582; CDS_LIB: c_discrete; VARIANT: ?; PCB Footprint: CTK0_SM0402_1100X550_MA; ROT: 0; CHIPS_PART_NAME: C_RES; CDS_PART_NAME: C_RES_0402-A93549-001,EMPTY,0,5%,0.0625W,TK0,GENERIC; CDS_LOCATION: R26106
R26107 = C_RES#1: CHIPS_PART_NAME: C_RES; CDS_PHYS_PART_NAME: C_RES_0402-A93548-128,RES,100K,1%,0.0625W,TK0,GENERIC; CDS_LMAN_SYM_OUTLINE: -50,50,50,-50; FP_TECH: TK0; IP: GENERIC; ROOM: NONE; OriginalSymbolOrigin: (-75,25); XY: (-9125,2750); VER: 1; ROT: 0; PHYS_PAGE: 213; LOCATION: R26107; DRAWING: @RVP1_ADL_SB_ADP_S_DDR5_SODIMM_2DPC_LIB.H55_DG2_2DPC(SCH_1):PAGE582; CDS_LIB: c_discrete; VARIANT: ?; PCB Footprint: CTK0_SM0402_1100X550_MA; CDS_PART_NAME: C_RES_0402-A93548-128,RES,100K,1%,0.0625W,TK0,GENERIC; CDS_LOCATION: R26107
R26108 = C_RES: CDS_PHYS_PART_NAME: C_RES_0402-A93548-660,RES,5.1,1%,0.0625W,TK0,GENERIC; CDS_LMAN_SYM_OUTLINE: -50,50,50,-50; FP_TECH: TK0; IP: GENERIC; ROOM: NONE; OriginalSymbolOrigin: (-25,75); XY: (-12600,3525); VER: 2; ROT: 0; PHYS_PAGE: 213; LOCATION: R26108; DRAWING: @RVP1_ADL_SB_ADP_S_DDR5_SODIMM_2DPC_LIB.H55_DG2_2DPC(SCH_1):PAGE582; CDS_LIB: c_discrete; VARIANT: ?; PCB Footprint: CTK0_SM0402_1100X550_MA; CHIPS_PART_NAME: C_RES; CDS_PART_NAME: C_RES_0402-A93548-660,RES,5.1,1%,0.0625W,TK0,GENERIC; CDS_LOCATION: R26108
R26109 = C_RES#1: PART_NUMBER: A93549-001; CHIPS_PART_NAME: C_RES; CDS_PHYS_PART_NAME: C_RES_0402-A93549-001,RES,0,5%,0.0625W,TK2,GENERIC; CDS_LMAN_SYM_OUTLINE: -50,50,50,-50; FP_TECH: TK2; IP: GENERIC; ROOM: NONE; WATTAGE: 0.0625W; OriginalSymbolOrigin: (-75,25); XY: (-12375,2850); VER: 1; PHYS_PAGE: 213; LOCATION: R26109; DRAWING: @RVP1_ADL_SB_ADP_S_DDR5_SODIMM_2DPC_LIB.H55_DG2_2DPC(SCH_1):PAGE582; CDS_LIB: c_discrete; VARIANT: ?; PCB Footprint: CTK2_SM0402_1100X550_MA; ROT: 0; CDS_PART_NAME: C_RES_0402-A93549-001,RES,0,5%,0.0625W,TK2,GENERIC; CDS_LOCATION: R26109
R26110 = C_RES#1: PART_NUMBER: A93549-001; CHIPS_PART_NAME: C_RES; CDS_PHYS_PART_NAME: C_RES_0402-A93549-001,EMPTY,0,5%,0.0625W,TK2,GENERIC; CDS_LMAN_SYM_OUTLINE: -50,50,50,-50; FP_TECH: TK2; IP: GENERIC; ROOM: NONE; WATTAGE: 0.0625W; OriginalSymbolOrigin: (-75,25); XY: (-12350,2550); VER: 1; PHYS_PAGE: 213; LOCATION: R26110; DRAWING: @RVP1_ADL_SB_ADP_S_DDR5_SODIMM_2DPC_LIB.H55_DG2_2DPC(SCH_1):PAGE582; CDS_LIB: c_discrete; VARIANT: ?; PCB Footprint: CTK2_SM0402_1100X550_MA; ROT: 0; CDS_PART_NAME: C_RES_0402-A93549-001,EMPTY,0,5%,0.0625W,TK2,GENERIC; CDS_LOCATION: R26110
R26111 = C_RES: CDS_PHYS_PART_NAME: C_RES_0402-A93549-001,RES,0,5%,0.0625W,TK2,GENERIC; CDS_LMAN_SYM_OUTLINE: -50,50,50,-50; FP_TECH: TK2; IP: GENERIC; ROOM: NONE; OriginalSymbolOrigin: (-25,75); XY: (-10225,2475); VER: 2; PHYS_PAGE: 213; LOCATION: R26111; DRAWING: @RVP1_ADL_SB_ADP_S_DDR5_SODIMM_2DPC_LIB.H55_DG2_2DPC(SCH_1):PAGE582; CDS_LIB: c_discrete; VARIANT: ?; PCB Footprint: CTK2_SM0402_1100X550_MA; ROT: 0; CHIPS_PART_NAME: C_RES; CDS_PART_NAME: C_RES_0402-A93549-001,RES,0,5%,0.0625W,TK2,GENERIC; CDS_LOCATION: R26111
R26112 = C_RES: CDS_PHYS_PART_NAME: C_RES_0402-A93548-181,RES,20K,1%,0.0625,TK0,GENERIC; CDS_LMAN_SYM_OUTLINE: -50,50,50,-50; FP_TECH: TK0; IP: GENERIC; ROOM: NONE; OriginalSymbolOrigin: (-25,75); XY: (-8425,2750); VER: 2; ROT: 0; PHYS_PAGE: 213; LOCATION: R26112; DRAWING: @RVP1_ADL_SB_ADP_S_DDR5_SODIMM_2DPC_LIB.H55_DG2_2DPC(SCH_1):PAGE582; CDS_LIB: c_discrete; VARIANT: ?; PCB Footprint: CTK0_SM0402_1100X550_MA; CHIPS_PART_NAME: C_RES; CDS_PART_NAME: C_RES_0402-A93548-181,RES,20K,1%,0.0625,TK0,GENERIC; CDS_LOCATION: R26112
R26113 = RES: CDS_PHYS_PART_NAME: RES_0402-A93549-027,CHIP,100K,5%,1/16W,LPDB,GENERIC; OriginalSymbolOrigin: (-25,75); XY: (-12450,1600); VER: 2; ROT: 0; PHYS_PAGE: 213; LOCATION: R26113; IP: GENERIC; FP_TECH: LPDB; DRAWING: @RVP1_ADL_SB_ADP_S_DDR5_SODIMM_2DPC_LIB.H55_DG2_2DPC(SCH_1):PAGE582; CDS_LIB: discrete; PCB Footprint: SMR0402IA; CHIPS_PART_NAME: RES; CDS_PART_NAME: RES_0402-A93549-027,CHIP,100K,5%,1/16W,LPDB,GENERIC; CDS_LOCATION: R26113
U26101 = C_MP2941H: CDS_PHYS_PART_NAME: C_MP2941H_LCC-M10224-001,IC,MP2941HGL,TK1,GENERIC; CDS_LMAN_SYM_OUTLINE: -300,500,300,-500; FP_TECH: TK1; IP: GENERIC; PACK_TYPE: LCC; ROOM: NONE; OriginalSymbolOrigin: (-325,500); XY: (-11300,2950); VER: 1; ROT: 0; PHYS_PAGE: 213; LOCATION: U26101; DRAWING: @RVP1_ADL_SB_ADP_S_DDR5_SODIMM_2DPC_LIB.H55_DG2_2DPC(SCH_1):PAGE582; CDS_LIB: local; VARIANT: ?; PCB Footprint: CTK1_LCC19_3100X4100_400_MA; SEC_TYPE: LCC; CHIPS_PART_NAME: C_MP2941H; CDS_PART_NAME: C_MP2941H_LCC-M10224-001,IC,MP2941HGL,TK1,GENERIC; CDS_LOCATION: U26101